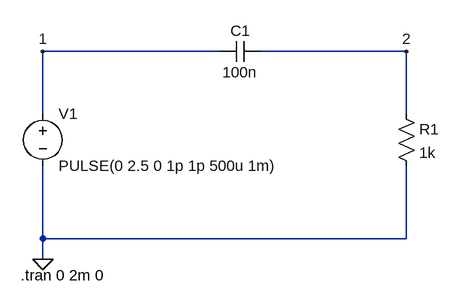
[diagram p0: schematic zvuk-silence.asc]
zvuk-silence.asc, the LTspice schematic file:
Version 4
SHEET 1 880 680
WIRE 320 32 48 32
WIRE 608 32 384 32
WIRE 48 128 48 32
WIRE 608 128 608 32
WIRE 48 320 48 208
WIRE 608 320 608 208
WIRE 608 320 48 320
WIRE 48 352 48 320
FLAG 48 352 0
FLAG 48 32 1
FLAG 608 32 2
SYMBOL voltage 48 112 R0
WINDOW 123 0 0 Left 0
WINDOW 39 0 0 Left 0
SYMATTR InstName V1
SYMATTR Value PULSE(0 2.5 0 1p 1p 500u 1m)
SYMBOL res 592 112 R0
SYMATTR InstName R1
SYMATTR Value 1k
SYMBOL cap 384 16 R90
WINDOW 0 0 32 VBottom 2
WINDOW 3 32 32 VTop 2
SYMATTR InstName C1
SYMATTR Value 100n
TEXT 14 376 Left 2 !.tran 0 2m 0

The netlist it stands for:
* zvuk-silence.asc
V1 1 0 PULSE(0 2.5 0 1p 1p 500u 1m)
R1 2 0 1k
C1 2 1 100n
.tran 0 2m 0
.backanno
.end